# EAGLE design buffer (EAGLE 9.6.2)
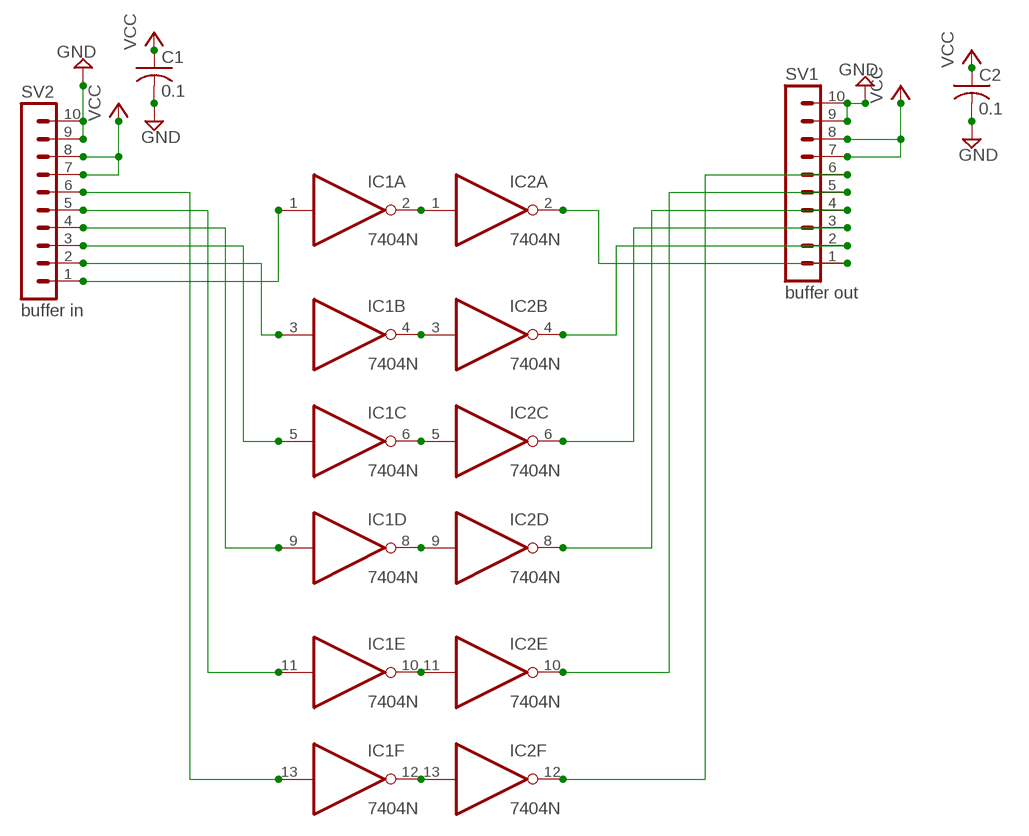
[diagram p0: schematic, sheet 1]

## Parts
C1  0.1  C-USC1206  [C1206]
C2  0.1  C-USC1206  [C1206]
IC1  7404N  [DIL14]
IC2  7404N  [DIL14]
SV1  buffer out  MA10-1  [MA10-1]
SV2  buffer in  MA10-1  [MA10-1]

## Nets
GND [icurrent]: C1.2 C2.2 SV1.9 SV1.10 SV2.9 SV2.10
N$1: IC1.4(B:O) IC2.3(B:I)
N$2: IC1.6(C:O) IC2.5(C:I)
N$3: IC1.8(D:O) IC2.9(D:I)
N$4: IC1.10(E:O) IC2.11(E:I)
N$5: IC1.12(F:O) IC2.13(F:I)
N$6: IC1.2(A:O) IC2.1(A:I)
N$7: IC1.1(A:I) SV2.1
N$8: IC1.3(B:I) SV2.2
N$9: IC1.5(C:I) SV2.3
N$10: IC1.9(D:I) SV2.4
N$11: IC1.11(E:I) SV2.5
N$12: IC1.13(F:I) SV2.6
N$13: IC2.2(A:O) SV1.1
N$14: IC2.4(B:O) SV1.2
N$15: IC2.6(C:O) SV1.3
N$16: IC2.8(D:O) SV1.4
N$17: IC2.10(E:O) SV1.5
N$18: IC2.12(F:O) SV1.6
VCC [icurrent]: C1.1 C2.1 SV1.7 SV1.8 SV2.7 SV2.8

## Power pins joined to a net without a drawn wire
GND: IC1.7(P:GND) IC2.7(P:GND)
VCC: IC1.14(P:VCC) IC2.14(P:VCC)

## Library data of the parts
C1 C2 = rcl:C-US: CAPACITOR, American symbol; SPICEPREFIX: C
IC1 IC2 = 74xx-us:74*04: Hex INVERTER
SV1 SV2 = con-lstb:MA10-1: PIN HEADER; OC_FARNELL: unknown; OC_NEWARK: unknown

## Net classes
1 icurrent: width 0.305 mm

## Board
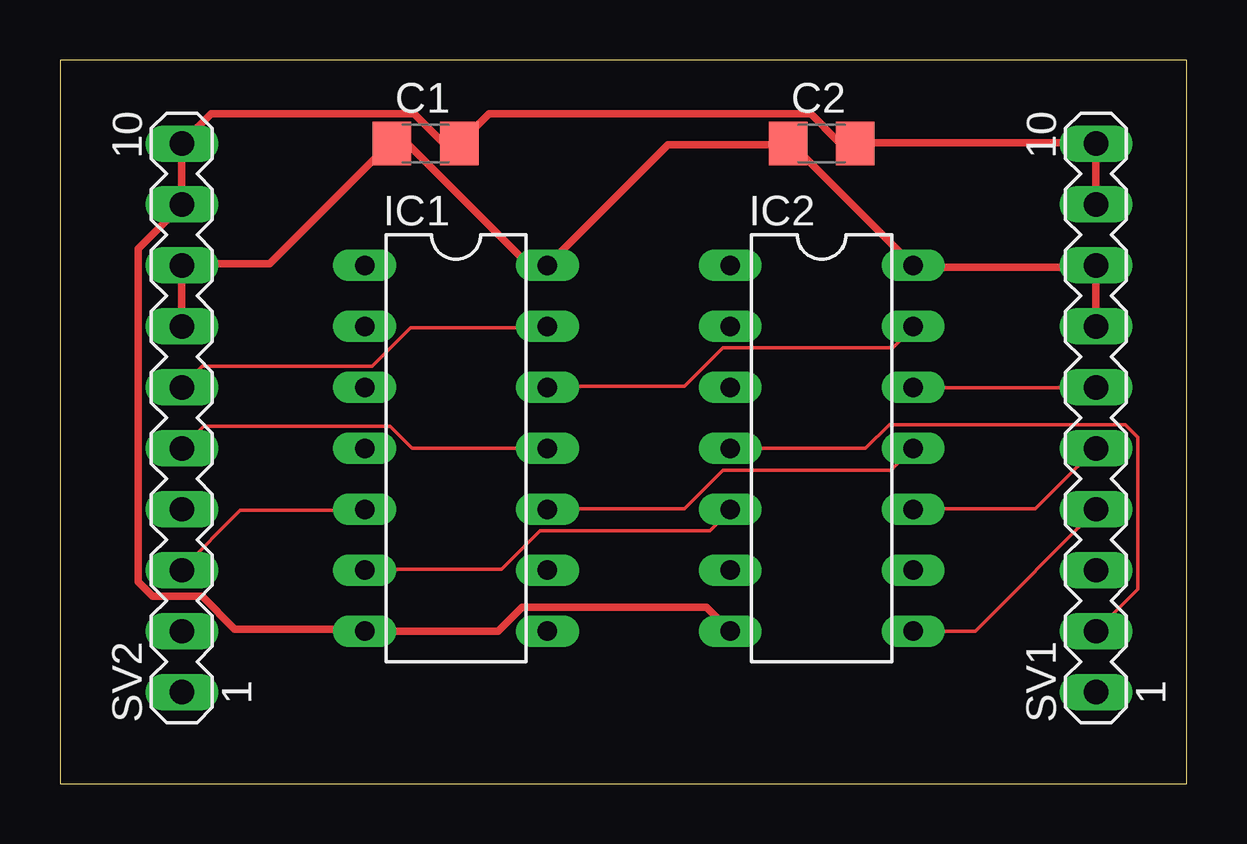
[diagram p1: board, top side]
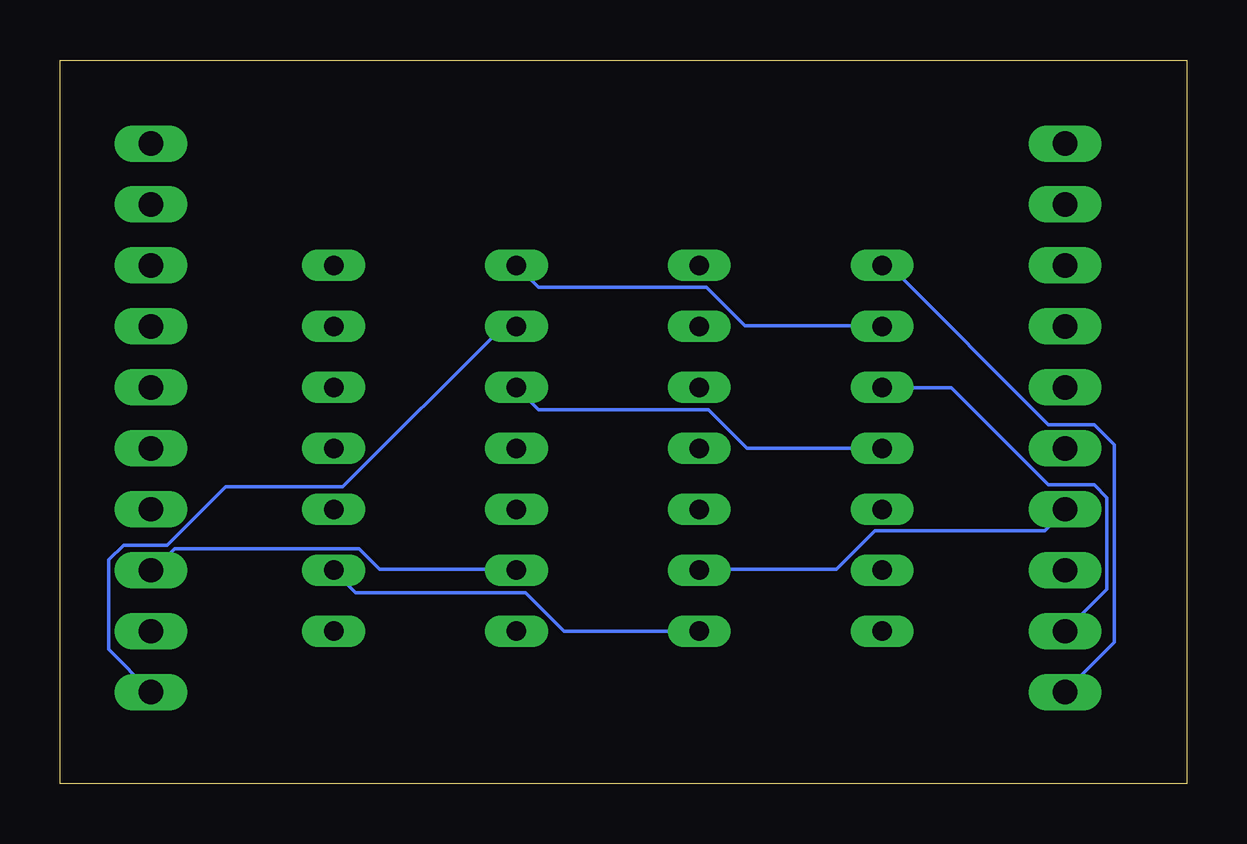
[diagram p2: board, bottom side, seen from below]

Size 46.97 x 30.15 mm. Coordinates in mm from the lower left corner, seen from the top.
Outline: 0,0 46.97,0 46.97,30.15 0,30.15 0,0
Copper layers (1*16): Top 0.035mm / dielectric 1.5mm / Bottom 0.035mm
Design rules "default": minimum track width 6mil, minimum drill 0.35mm, track to track 6mil, track to pad 6mil, pad to pad 6mil, via to via 6mil, smd to smd 6mil, copper to edge 40mil, drill to drill 6mil, minimum pad ring 10mil, minimum via ring 8mil, stop-mask expansion 4mil, vias tented up to drill 0mil, thermal gap 10mil

### Footprints (pad centres in the part's own frame; a part is rotated, then mirrored left to right if it is on the bottom)
C1206 = smd 1.6 x 1.8: 1 -1.4,0; 2 1.4,0
DIL14 = drill 0.813 long: 1 -7.62,-3.81; 2 -5.08,-3.81; 3 -2.54,-3.81; 4 0,-3.81; 5 2.54,-3.81; 6 5.08,-3.81; 7 7.62,-3.81; 8 7.62,3.81; 9 5.08,3.81; 10 2.54,3.81; 11 0,3.81; 12 -2.54,3.81; 13 -5.08,3.81; 14 -7.62,3.81
MA10-1 = drill 1.016 long: 1 -11.43,0; 2 -8.89,0; 3 -6.35,0; 4 -3.81,0; 5 -1.27,0; 6 1.27,0; 7 3.81,0; 8 6.35,0; 9 8.89,0; 10 11.43,0

### Placement (x,y rotation side)
C1  15.24,26.67 0 top
C2  31.75,26.67 0 top
IC1  16.51,13.97 270 top
IC2  31.75,13.97 270 top
SV1  43.18,15.24 90 top
SV2  5.08,15.24 90 top

### Tracks (layer width: path | path; a pad name or v marks a point on that pad's centre or on a via)
GND
  Top 0.305: IC2.7 26.95,7.34 19.25,7.34 18.26,6.35 IC1.7 12.62,6.43 7.29,6.43 5.92,7.8 3.86,7.8 3.25,8.41 3.25,22.28 5,24.03 SV2.9 SV2.10 5.08,26.7 6.3,27.91 14.76,27.91 15.98,26.7 16.59,26.7 C1.2 16.74,26.77 17.88,27.91 31.29,27.91 32.44,26.77 33.05,26.77 C2.2 33.2,26.7 43.18,26.7 SV1.10 SV1.9
N$1
  Bottom 0.152: IC1.4 18.34,13.97 19.94,15.57 27.03,15.57 27.94,16.48 IC2.3
N$2
  Top 0.152: IC1.6 12.7,8.94 18.42,8.94 20.02,10.54 27.1,10.54 27.94,11.38 IC2.5
N$3
  Bottom 0.152: IC1.8 25.96,6.35 27.56,7.95 34.65,7.95 35.56,8.87 IC2.9
N$4
  Top 0.152: IC2.11 34.65,13.06 27.64,13.06 26.04,11.46 20.32,11.46 IC1.10
N$5
  Top 0.152: IC1.12 20.32,16.56 26.04,16.56 27.64,18.16 34.72,18.16 35.56,19 IC2.13
N$6
  Bottom 0.152: IC2.1 27.03,20.68 20.02,20.68 18.42,19.08 12.7,19.08 IC1.2
N$7
  Bottom 0.152: IC1.1 12.4,21.59 5.77,14.96 3.86,14.96 3.02,14.12 3.02,5.89 5.08,3.83 SV2.1
N$8
  Bottom 0.152: SV2.2 3.33,8.1 3.33,11.91 3.86,12.45 5.77,12.45 9.8,16.48 12.7,16.48 IC1.3
N$9
  Top 0.152: IC1.5 12.7,11.38 7.52,11.38 5.08,8.94 SV2.3
N$10
  Bottom 0.152: IC1.9 20.32,8.94 14.61,8.94 13.01,10.54 5.92,10.54 5.08,11.38 SV2.4
N$11
  Top 0.152: IC1.11 14.68,13.97 13.77,14.88 5.99,14.88 SV2.5
N$12
  Top 0.152: IC1.13 20.32,19 14.61,19 13.01,17.4 5.92,17.4 5.08,16.56 SV2.6
N$13
  Bottom 0.152: IC2.2 27.94,19 28.55,19 35.18,12.37 40.06,12.37 42.49,9.93 44.32,9.93 44.93,9.32 44.93,5.59 43.18,3.83 SV1.1
N$14
  Top 0.152: IC2.4 33.58,13.97 34.57,14.96 44.4,14.96 44.93,14.43 44.93,8.1 SV1.2
N$15
  Bottom 0.152: IC2.6 27.94,8.94 33.66,8.94 34.49,9.78 42.19,9.78 43.03,8.94 43.18,8.94 SV1.3
N$16
  Top 0.152: IC2.8 38.15,6.35 43.18,11.38 SV1.4
N$17
  Top 0.152: SV1.5 40.66,11.46 35.56,11.46 IC2.10
N$18
  Top 0.152: IC2.12 35.56,16.48 43.18,16.48 SV1.6
VCC
  Top 0.305: SV1.7 SV1.8 43.1,21.51 35.64,21.51 IC2.14 30.53,26.62 30.38,26.62 C2.1 30.23,26.62 25.35,26.62 IC1.14 19.56,21.59 14.53,26.62 13.84,26.62 C1.1 13.69,26.62 8.74,21.67 5.16,21.67 SV2.8 SV2.7